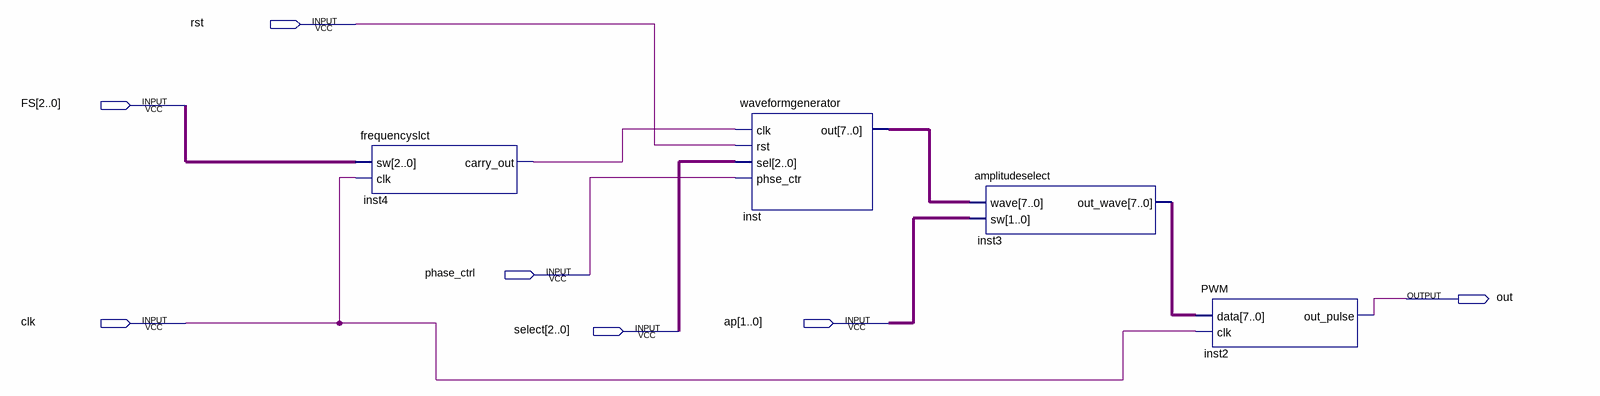
[diagram p0: schematic sheet]
// Quartus schematic FG.bdf as structural Verilog: 4 symbols, 7 pins
module FG (
  input  rst,
  input  [2:0] FS,
  input  phase_ctrl,
  input  clk,
  input  [1:0] ap,
  input  [2:0] select,
  output out
);

  wire inst4_carry_out;
  wire [7:0] inst3_out_wave, inst_out;

  frequencyslct inst4 (.sw(FS), .clk(clk), .carry_out(inst4_carry_out));
  waveformgenerator inst (.clk(inst4_carry_out), .rst(rst), .sel(select), .phse_ctr(phase_ctrl), .out(inst_out));
  amplitudeselect inst3 (.wave(inst_out), .sw(ap), .out_wave(inst3_out_wave));
  PWM inst2 (.data(inst3_out_wave), .clk(clk), .out_pulse(out));
endmodule
